# Altium schematic sheet Sheet1.SchDoc
size A; SheetNumber: 1; SheetTotal: 2
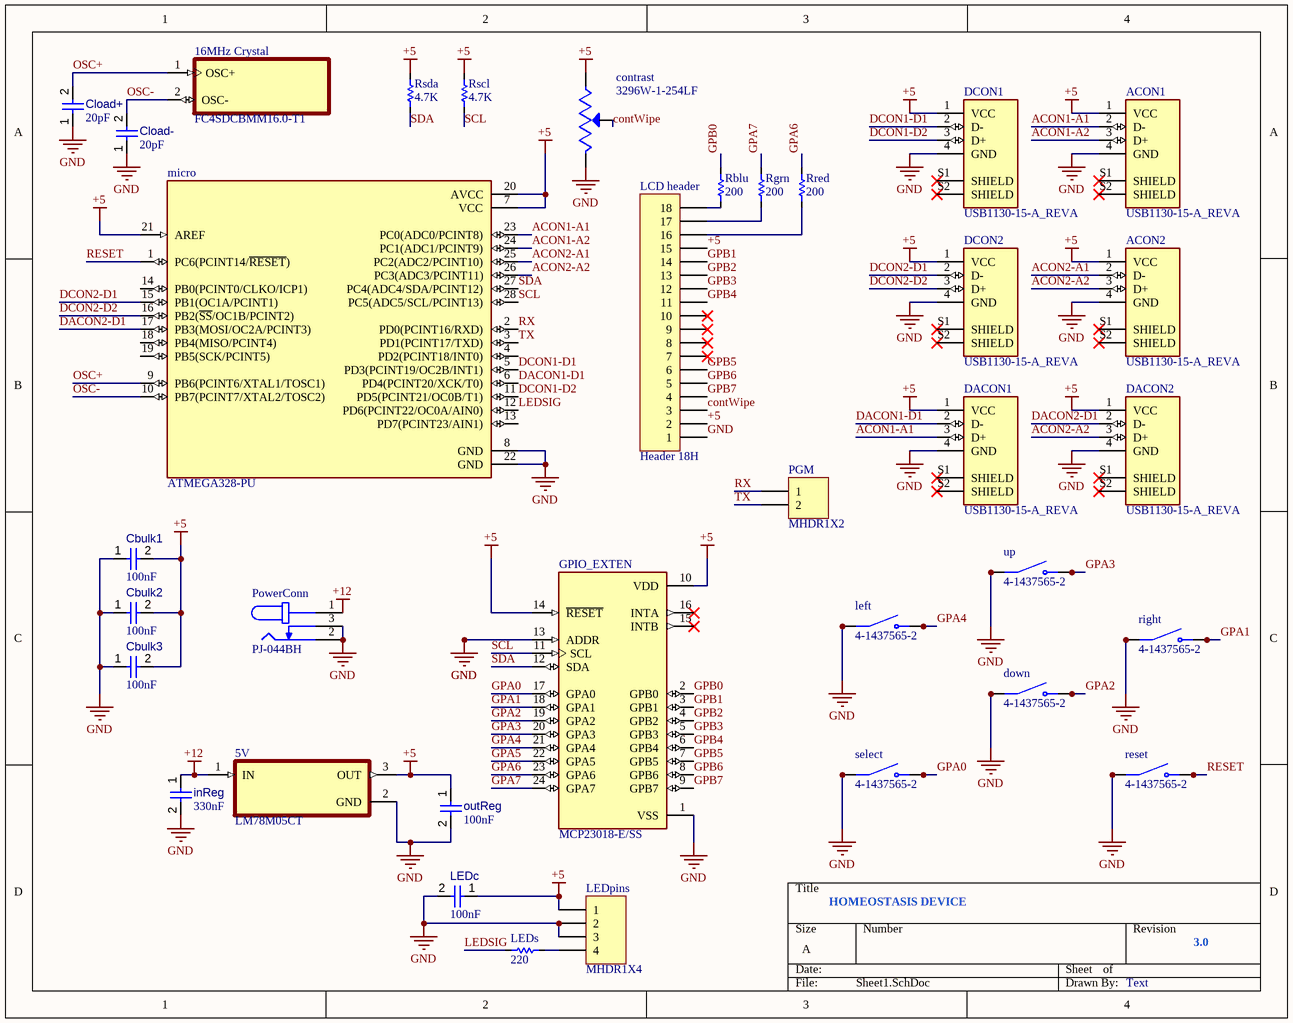
[diagram p0: Sheet1.SchDoc]

## Parts
5V  LM78M05CT  [TO254P1054X470X1955-3]
16MHz_Crystal  FC4SDCBMM16.0-T1  [XTAL_FOXSDLF/160-20]
ACON1  USB1130-15-A_REVA  [GCT_USB1130-15-A_REVA]
ACON2  USB1130-15-A_REVA  [GCT_USB1130-15-A_REVA]
Cbulk1  value 100nF  [CAPC0805(2012)145_L]  (hidden comment: Capacitor 4.7µF +/-40% 25V 0805)
Cbulk2  value 100nF  [CAPC0805(2012)145_L]  (hidden comment: Capacitor 4.7µF +/-40% 25V 0805)
Cbulk3  value 100nF  [CAPC0805(2012)145_L]  (hidden comment: Capacitor 4.7µF +/-40% 25V 0805)
Cload+  value 20pF  [CAPC2013X135X45ML10T25]  (hidden comment: Capacitor 1 uF +/- 10% 50 V 0805)
Cload-  value 20pF  [CAPC2013X135X45ML10T25]  (hidden comment: Capacitor 1 uF +/- 10% 50 V 0805)
contrast  3296W-1-254LF  [TRIM_3296W-1-254LF]
DACON1  USB1130-15-A_REVA  [GCT_USB1130-15-A_REVA]
DACON2  USB1130-15-A_REVA  [GCT_USB1130-15-A_REVA]
DCON1  USB1130-15-A_REVA  [GCT_USB1130-15-A_REVA]
DCON2  USB1130-15-A_REVA  [GCT_USB1130-15-A_REVA]
down  4-1437565-2  [SW_4-1437565-2]
GPIO_EXTEN  MCP23018-E/SS  [SOP65P780X200-24N]
inReg  value 330nF  [CAPC0805(2012)145_L]  (hidden comment: Capacitor 4.7µF +/-40% 25V 0805)
LCD_header  Header 18H  [HDR1X18H]
LEDc  value 100nF  [CAPC0805(2012)145_L]  (hidden comment: Capacitor 4.7µF +/-40% 25V 0805)
LEDpins  MHDR1X4  [MHDR1X4]
LEDs  value 220  [0805_Resistor]  (hidden comment: R_0805_4.7K_1%)
left  4-1437565-2  [SW_4-1437565-2]
micro  ATMEGA328-PU  [DIP787W46P254L3467H508Q28]
outReg  value 100nF  [CAPC0805(2012)145_L]  (hidden comment: Capacitor 4.7µF +/-40% 25V 0805)
PGM  MHDR1X2  [MHDR1X2]
PowerConn  PJ-044BH  [CUI_PJ-044BH]
Rblu  value 200  [0805_Resistor]  (hidden comment: R_0805_200_1%)
reset  4-1437565-2  [SW_4-1437565-2]
Rgrn  value 200  [0805_Resistor]  (hidden comment: R_0805_200_1%)
right  4-1437565-2  [SW_4-1437565-2]
Rred  value 200  [0805_Resistor]  (hidden comment: R_0805_200_1%)
Rscl  value 4.7K  [0805_Resistor]  (hidden comment: R_0805_4.7K_1%)
Rsda  value 4.7K  [0805_Resistor]  (hidden comment: R_0805_4.7K_1%)
select  4-1437565-2  [SW_4-1437565-2]
up  4-1437565-2  [SW_4-1437565-2]

## Nets
+5: 5V.3(OUT) ACON1.1(VCC) ACON2.1(VCC) Cbulk1.2 Cbulk2.2 Cbulk3.2 contrast.1(CCW) DACON1.1(VCC) DACON2.1(VCC) DCON1.1(VCC) DCON2.1(VCC) GPIO_EXTEN.10(VDD) GPIO_EXTEN.14(~{RESET}) LCD_header.2 LCD_header.15 LEDc.1 LEDpins.1 micro.7(VCC) micro.20(AVCC) micro.21(AREF) outReg.1 Rscl.1 Rsda.1
+12: 5V.1(IN) inReg.1 PowerConn.1
GND: 5V.2(GND) ACON1.4(GND) ACON2.4(GND) Cbulk1.1 Cbulk2.1 Cbulk3.1 Cload+.1 Cload-.1 contrast.3(CW) DACON1.4(GND) DACON2.4(GND) DCON1.4(GND) DCON2.4(GND) down.1(COM) down.2(COM) GPIO_EXTEN.1(VSS) GPIO_EXTEN.13(ADDR) inReg.2 LCD_header.1 LEDc.2 LEDpins.2 LEDpins.3 left.1(COM) left.2(COM) micro.8(GND) micro.22(GND) outReg.2 PowerConn.2 PowerConn.3 reset.1(COM) reset.2(COM) right.1(COM) right.2(COM) select.1(COM) select.2(COM) up.1(COM) up.2(COM)
ACON1-A1: ACON1.2(D-) DACON1.3(D+) micro.23(PC0(ADC0/PCINT8))
ACON1-A2: ACON1.3(D+) micro.24(PC1(ADC1/PCINT9))
ACON2-A1: ACON2.2(D-) micro.25(PC2(ADC2/PCINT10))
ACON2-A2: ACON2.3(D+) DACON2.3(D+) micro.26(PC3(ADC3/PCINT11))
contWipe: contrast.2(WIPER) LCD_header.3
DACON1-D1: DACON1.2(D-) micro.6(PD4(PCINT20/XCK/T0))
DACON2-D1: DACON2.2(D-) micro.17(PB3(MOSI/OC2A/PCINT3))
DCON1-D1: DCON1.2(D-) micro.5(PD3(PCINT19/OC2B/INT1))
DCON1-D2: DCON1.3(D+) micro.11(PD5(PCINT21/OC0B/T1))
DCON2-D1: DCON2.2(D-) micro.15(PB1(OC1A/PCINT1))
DCON2-D2: DCON2.3(D+) micro.16(PB2(~{SS}/OC1B/PCINT2))
GPA0: GPIO_EXTEN.17(GPA0) select.3(NO) select.4(NO)
GPA1: GPIO_EXTEN.18(GPA1) right.3(NO) right.4(NO)
GPA2: down.3(NO) down.4(NO) GPIO_EXTEN.19(GPA2)
GPA3: GPIO_EXTEN.20(GPA3) up.3(NO) up.4(NO)
GPA4: GPIO_EXTEN.21(GPA4) left.3(NO) left.4(NO)
GPA5: GPIO_EXTEN.22(GPA5)
GPA6: GPIO_EXTEN.23(GPA6) Rred.2
GPA7: GPIO_EXTEN.24(GPA7) Rgrn.2
GPB0: GPIO_EXTEN.2(GPB0) Rblu.2
GPB1: GPIO_EXTEN.3(GPB1) LCD_header.14
GPB2: GPIO_EXTEN.4(GPB2) LCD_header.13
GPB3: GPIO_EXTEN.5(GPB3) LCD_header.12
GPB4: GPIO_EXTEN.6(GPB4) LCD_header.11
GPB5: GPIO_EXTEN.7(GPB5) LCD_header.6
GPB6: GPIO_EXTEN.8(GPB6) LCD_header.5
GPB7: GPIO_EXTEN.9(GPB7) LCD_header.4
LEDSIG: LEDs.1 micro.12(PD6(PCINT22/OC0A/AIN0))
OSC+: 16MHz_Crystal.1(OSC+) Cload+.2 micro.9(PB6(PCINT6/XTAL1/TOSC1))
OSC-: 16MHz_Crystal.2(OSC-) Cload-.2 micro.10(PB7(PCINT7/XTAL2/TOSC2))
RESET: micro.1(PC6(PCINT14/~{RESET})) reset.3(NO) reset.4(NO)
RX: micro.2(PD0(PCINT16/RXD)) PGM.1
SCL: GPIO_EXTEN.11(SCL) micro.28(PC5(ADC5/SCL/PCINT13)) Rscl.2
SDA: GPIO_EXTEN.12(SDA) micro.27(PC4(ADC4/SDA/PCINT12)) Rsda.2
TX: micro.3(PD1(PCINT17/TXD)) PGM.2
NetLCD_header_16: LCD_header.16 Rred.1
NetLCD_header_17: LCD_header.17 Rgrn.1
NetLCD_header_18: LCD_header.18 Rblu.1
NetLEDpins_4: LEDpins.4 LEDs.2

Not connected (* = marked no-connect by the designer): ACON1 S1(SHIELD)* S2(SHIELD)*; ACON2 S1(SHIELD)* S2(SHIELD)*; DACON1 S1(SHIELD)* S2(SHIELD)*; DACON2 S1(SHIELD)* S2(SHIELD)*; DCON1 S1(SHIELD)* S2(SHIELD)*; DCON2 S1(SHIELD)* S2(SHIELD)*; GPIO_EXTEN 15(INTB)* 16(INTA)*; LCD_header 7* 8* 9* 10*; micro 4(PD2(PCINT18/INT0)) 13(PD7(PCINT23/AIN1)) 14(PB0(PCINT0/CLKO/ICP1)) 18(PB4(MISO/PCINT4)) 19(PB5(SCK/PCINT5))

## Notes on the sheet
- HOMEOSTASIS DEVICE
- 3.0
- Text

## Library data of the parts
5V = LM78M05CT: Linear Voltage Regulator IC 1 Output 500mA TO-220-3; MF: ON Semiconductor; MP: LM78M05CT; Package: TO-220 ON Semiconductor; Availability: Warning; Value: *; Price: None; Check_prices: https://www.snapeda.com/parts/LM78M05CT/ON%20Semiconductor/view-part/2776523/?ref=eda; SnapEDA_Link: https://www.snapeda.com/parts/LM78M05CT/ON%20Semiconductor/view-part/2776523/?ref=snap; Purchase-URL: https://pricing.snapeda.com/search/part/LM78M05CT/?ref=eda
16MHz_Crystal = FC4SDCBMM16.0-T1: 16 MHz Â±30ppm Crystal 20pF 40 Ohms HC-49/US; MF: Fox Electronics; SnapEDA_Link: https://www.snapeda.com/parts/FC4SDCBMM16.0-T1/Fox+Electronics/view-part/?ref=snap; Package: HC-49/US Fox Electronics; MP: FC4SDCBMM16.0-T1; Value: *; Purchase-URL: https://pricing.snapeda.com/search/part/FC4SDCBMM16.0-T1/?ref=eda; Check_prices: https://www.snapeda.com/parts/FC4SDCBMM16.0-T1/Fox+Electronics/view-part/?ref=eda; Availability: In Stock; Price: None
ACON1 ACON2 DACON1 DACON2 DCON1 DCON2 = USB1130-15-A_REVA: MF: {'manufacturer': u'Global Connector Technology'}; MP: USB1130-15-A_REVA; Value: *; Price: None; Package: None; Availability: Unavailable
Cbulk1-Cbulk3 inReg LEDc outReg = CMP-001-00080-5: Chip Capacitor, 4.7µF +/-40%, 25V, 0805, Thickness 1.45 mm; Tolerance: 20%; Capacitor Type: Ceramic; Case/Package: 0805; Max Operating Temperature: 85°C; Mounting Technology: SMT; Min Operating Temperature: -55°C; Voltage Rating: 25V; Pins: 2
Cload+ Cload- = CMP-001-00007-7: Chip Capacitor, 1 uF, +/- 10%, 50 V, 0805 (2012 Metric); Capacitor Type: Ceramic; Voltage Rating: 50V; Mounting Technology: SMT; Tolerance: 10%; Pins: 2; Max Operating Temperature: 125°C; Min Operating Temperature: -55°C; Case/Package: 0805
contrast = 3296W-1-254LF: Res Cermet Trimmer 500K Ohm 10% 0.5W 25(Elec)Turn 2.19mm (9.53 X 4.83 X 11.55mm) Pin Thru-Hole Tube; MF: {'manufacturer': u'Bourns'}; Price: None; MP: 3296W-1-254LF; Value: *; Package: None; Availability: Unavailable
down left reset right select up = 4-1437565-2: MF: {'manufacturer': u'TE Connectivity'}; Price: None; MP: 4-1437565-2; Availability: Unavailable; Package: None; Value: *
GPIO_EXTEN = MCP23018-E/SS: IC: expander; 16bit I/O port; I2C; SSOP24; 1.8Ã·5.5VDC; MF: {'manufacturer': u'Microchip'}; Price: None; MP: MCP23018-E/SS; Availability: Unavailable; Package: None; Value: *
LCD_header = Header 18H: Header, 18-Pin, Right Angle; LatestRevisionDate: 17-Jul-2002; LatestRevisionNote: Re-released for DXP Platform.; Publisher: Altium Limited
LEDpins = MHDR1X4: Header, 4-Pin; LatestRevisionDate: 17-Jul-2002; LatestRevisionNote: Re-released for DXP Platform.; Publisher: Altium Limited
LEDs Rscl Rsda = CMP-058-000045-1: RES 4.7K OHM 1/8W 1% 0805 SMD; Manufacturer: Yageo; Manufacturer Part Number: AC0805FR-074K7L; SVP Creator: Andrew Wu; Power Rating: 0.125W; ComponentLink1Description: DigiKey; Source: resistor.SchLib; Design Item ID: R_0805_4.7K_1%; Package: 0805_Resistor; DigiKey PN: YAG3738TR-ND; ComponentLink1URL: https://www.digikey.com/products/en?keywords=YAG3738TR-ND
micro = ATMEGA328-PU: AVR AVRÂ® ATmega Microcontroller IC 8-Bit 20MHz 32KB (16K x 16) FLASH 28-PDIP; MF: {'manufacturer': u'Microchip Technology'}; Price: None; MP: ATMEGA328-PU; Value: *; Package: None; Availability: Unavailable
PGM = MHDR1X2: Header, 2-Pin; LatestRevisionDate: 17-Jul-2002; LatestRevisionNote: Re-released for DXP Platform.; Publisher: Altium Limited
PowerConn = PJ-044BH: 2.5 mm Center Pin, 5.0 A, Vertical, Through Hole, Dc Power Jack Connector; MF: {'manufacturer': u'CUI Devices'}; Package: None; MP: PJ-044BH; Value: *; Price: None; Availability: Unavailable
Rblu Rgrn Rred = CMP-058-000027-1: RES 200 OHM 1/8W 1% 0805 SMD; Manufacturer: Yageo; Manufacturer Part Number: RC0805FR-07200RL; Power Rating: 0.125W; SVP Creator: Spencer Berglund; ComponentLink1URL: https://www.digikey.com/products/en?keywords=311-200CRCT-ND; Source: resistor.SchLib; Design Item ID: R_0805_200_1%; DigiKey PN: 311-200CRCT-ND; Package: 0805_Resistor; ComponentLink1Description: DigiKey